# EAGLE design colorTemp (EAGLE 9.4.2)
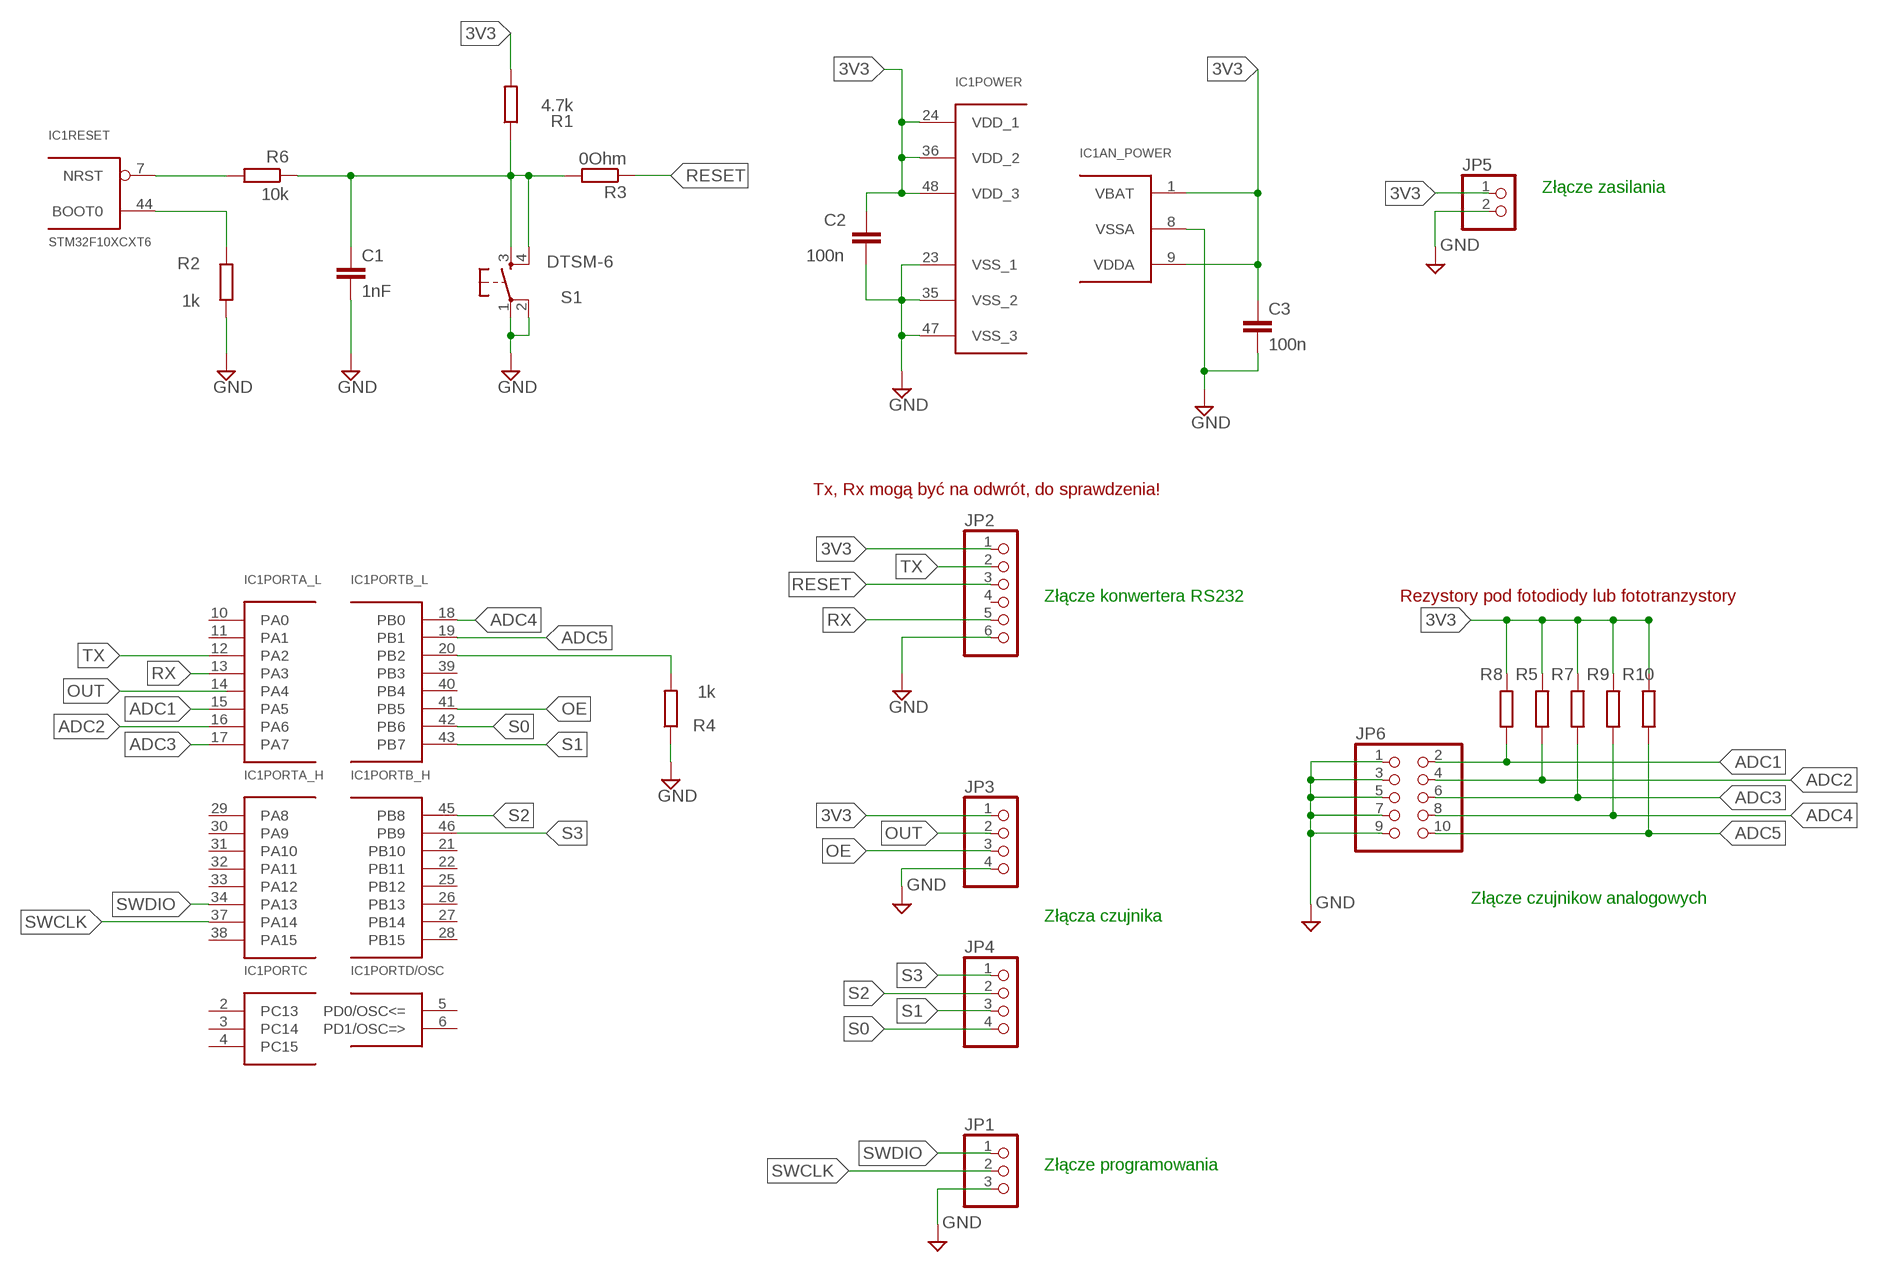
[diagram p0: schematic, sheet 1]

## Parts
C1  1nF  C-EUC0402  [C0402]
C2  100n  C-EUC0402  [C0402]
C3  100n  C-EUC0402  [C0402]
IC1  STM32F10XCXT6  [TQFP48]
JP1  PINHD-1X3  [1X03]
JP2  PINHD-1X6/90  [1X06/90]
JP3  PINHD-1X4  [1X04]
JP4  PINHD-1X4  [1X04]
JP5  PINHD-1X2  [1X02]
JP6  PINHD-2X5  [2X05]
R1  4.7k  R-EU_R0402  [R0402]
R2  1k  R-EU_R0402  [R0402]
R3  0Ohm  R-EU_R0402  [R0402]
R4  1k  R-EU_R0402  [R0402]
R5  R-EU_R0402  [R0402]
R6  10k  R-EU_R0402  [R0402]
R7  R-EU_R0402  [R0402]
R8  R-EU_R0402  [R0402]
R9  R-EU_R0402  [R0402]
R10  R-EU_R0402  [R0402]
S1  DTSM-6  [DTSM-6]

## Nets
3V3: C2.1 C3.1 IC1.1(AN_POWER:VBAT) IC1.9(AN_POWER:VDDA) IC1.24(POWER:VDD_1) IC1.36(POWER:VDD_2) IC1.48(POWER:VDD_3) JP2.1 JP3.1 JP5.1 R1.2 R5.1 R7.1 R8.1 R9.1 R10.1
ADC1: IC1.15(PORTA_L:PA5) JP6.2 R8.2
ADC2: IC1.16(PORTA_L:PA6) JP6.4 R5.2
ADC3: IC1.17(PORTA_L:PA7) JP6.6 R7.2
ADC4: IC1.18(PORTB_L:PB0) JP6.8 R9.2
ADC5: IC1.19(PORTB_L:PB1) JP6.10 R10.2
GND: C1.2 C2.2 C3.2 IC1.8(AN_POWER:VSSA) IC1.23(POWER:VSS_1) IC1.35(POWER:VSS_2) IC1.47(POWER:VSS_3) JP1.3 JP2.6 JP3.4 JP5.2 JP6.1 JP6.3 JP6.5 JP6.7 JP6.9 R2.1 R4.1 S1.1 S1.2
N$2: IC1.44(RESET:BOOT0) R2.2
N$9: IC1.20(PORTB_L:PB2) R4.2
N$18: IC1.7(RESET:NRST) R6.2
N$20: C1.1 R1.1 R3.2 R6.1 S1.3 S1.4
OE: IC1.41(PORTB_L:PB5) JP3.3
OUT: IC1.14(PORTA_L:PA4) JP3.2
RESET: JP2.3 R3.1
RX: IC1.13(PORTA_L:PA3) JP2.5
S0: IC1.42(PORTB_L:PB6) JP4.4
S1: IC1.43(PORTB_L:PB7) JP4.3
S2: IC1.45(PORTB_H:PB8) JP4.2
S3: IC1.46(PORTB_H:PB9) JP4.1
SWCLK: IC1.37(PORTA_H:PA14) JP1.2
SWDIO: IC1.34(PORTA_H:PA13) JP1.1
TX: IC1.12(PORTA_L:PA2) JP2.2
Unconnected: IC1.2(PORTC:PC13) IC1.3(PORTC:PC14) IC1.4(PORTC:PC15) IC1.5(PORTD/OSC:PD0/OSC<=) IC1.6(PORTD/OSC:PD1/OSC=>) IC1.10(PORTA_L:PA0) IC1.11(PORTA_L:PA1) IC1.21(PORTB_H:PB10) IC1.22(PORTB_H:PB11) IC1.25(PORTB_H:PB12) IC1.26(PORTB_H:PB13) IC1.27(PORTB_H:PB14) IC1.28(PORTB_H:PB15) IC1.29(PORTA_H:PA8) IC1.30(PORTA_H:PA9) IC1.31(PORTA_H:PA10) IC1.32(PORTA_H:PA11) IC1.33(PORTA_H:PA12) IC1.38(PORTA_H:PA15) IC1.39(PORTB_L:PB3) IC1.40(PORTB_L:PB4) JP2.4

## Notes on the sheet
- Złącze zasilania
- Tx, Rx mogą być na odwrót, do sprawdzenia!
- Złącze konwertera RS232 | Rezystory pod fotodiody lub fototranzystory
- Złącze czujnikow analogowych
- Złącza czujnika
- Złącze programowania

## Library data of the parts
C1-C3 = rcl:C-EU: CAPACITOR, European symbol; SPICEPREFIX: C
IC1 = stm32:STM32F10XCXT6: ST STM32F101/103 48pin LQFP
JP1 = pinhead:PINHD-1X3: PIN HEADER
JP2 = pinhead:PINHD-1X6: PIN HEADER
JP3 JP4 = pinhead:PINHD-1X4: PIN HEADER
JP5 = pinhead:PINHD-1X2: PIN HEADER
JP6 = pinhead:PINHD-2X5: PIN HEADER
R1-R10 = rcl:R-EU_: RESISTOR, European symbol; SPICEPREFIX: R
S1 = switch-tact:DTSM-6

## Board
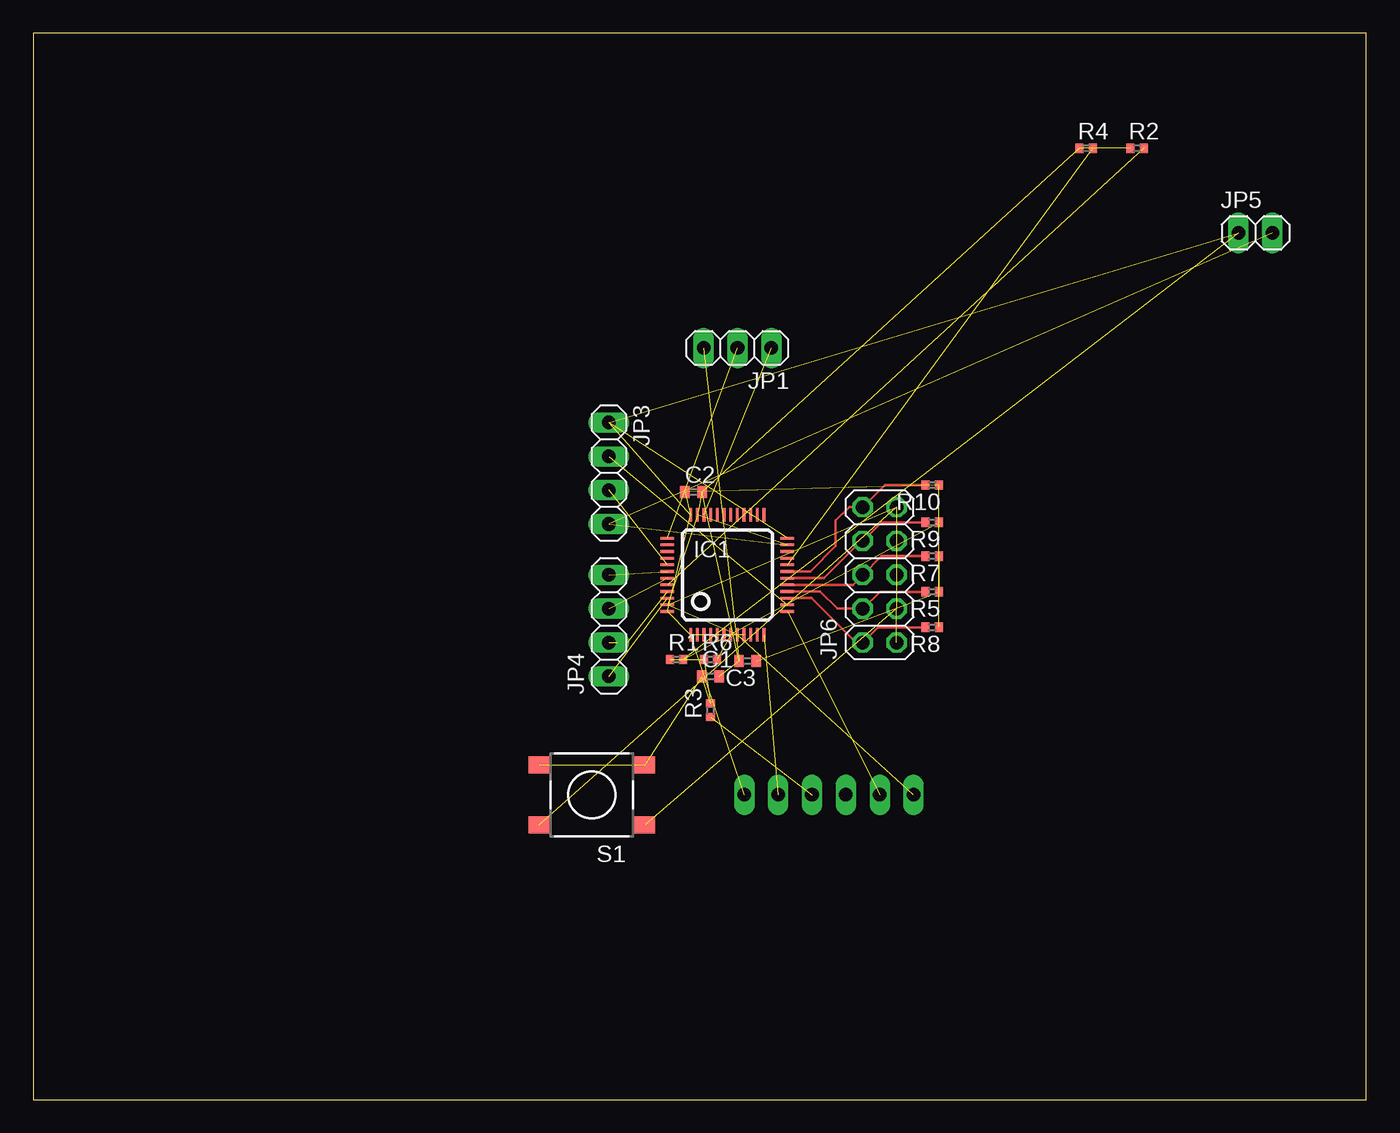
[diagram p1: board, top side]
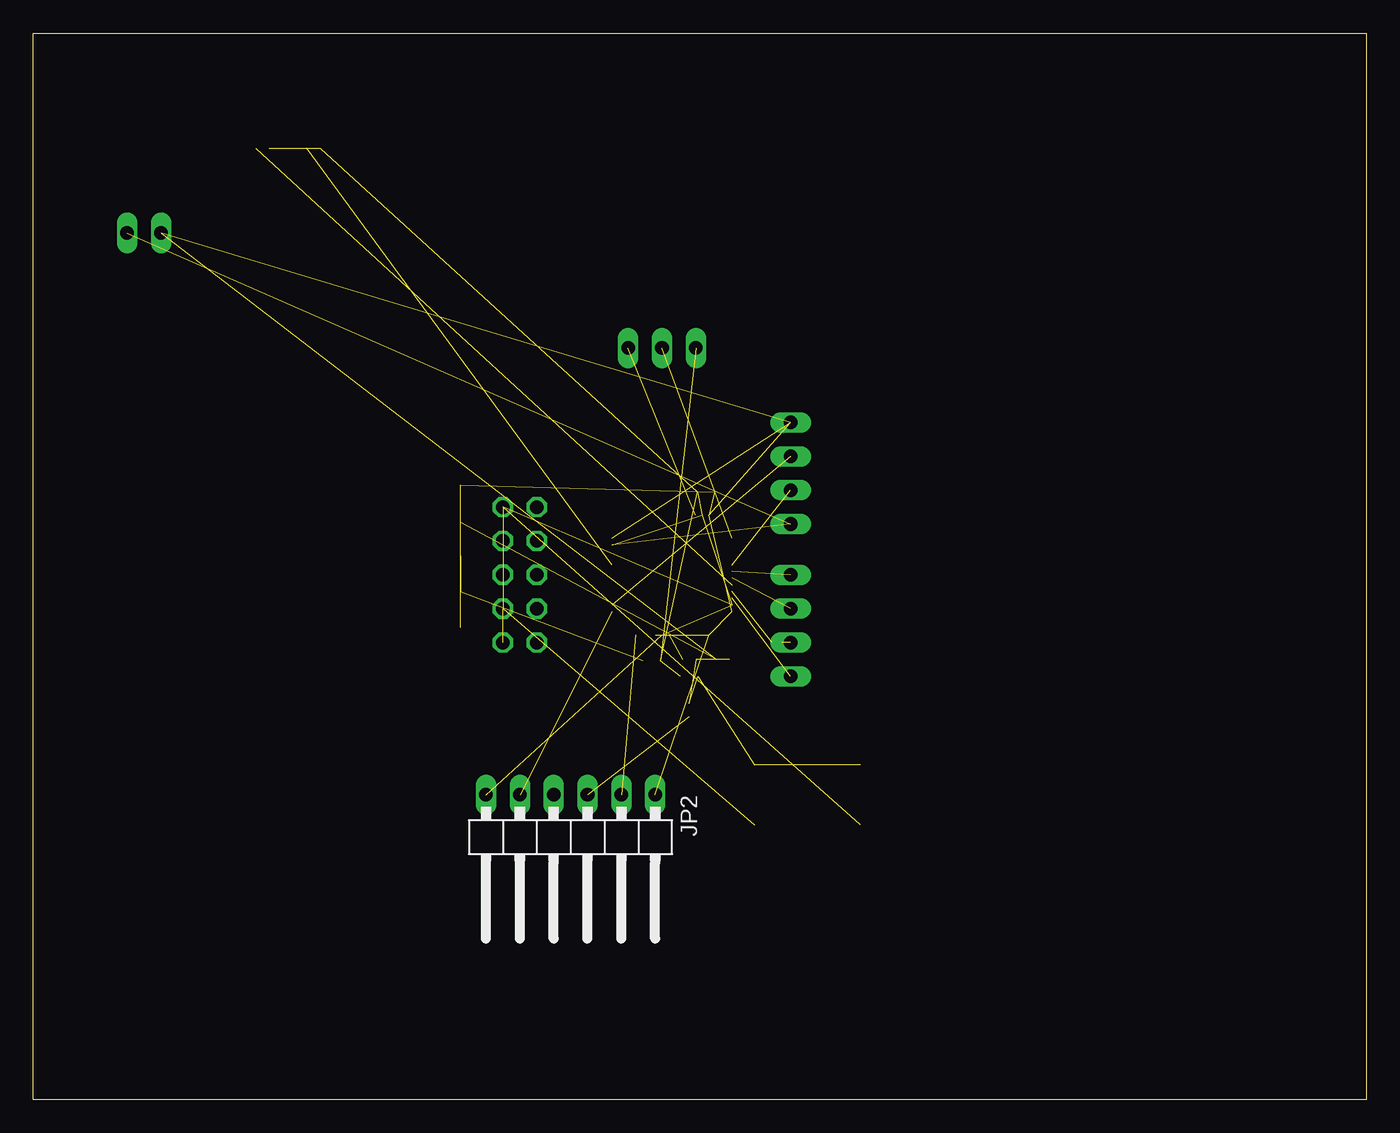
[diagram p2: board, bottom side, seen from below]

Size 100 x 80 mm. Coordinates in mm from the lower left corner, seen from the top.
Outline: 0,0 100,0 100,80 0,80 0,0
Copper layers (1*16): Top 0.035mm / dielectric 1.5mm / Bottom 0.035mm
Design rules "default": minimum track width 6mil, minimum drill 0.35mm, track to track 6mil, track to pad 6mil, pad to pad 6mil, via to via 6mil, smd to smd 6mil, copper to edge 40mil, drill to drill 6mil, minimum pad ring 10mil, minimum via ring 8mil, stop-mask expansion 4mil, vias tented up to drill 0mil, thermal gap 10mil

### Footprints (pad centres in the part's own frame; a part is rotated, then mirrored left to right if it is on the bottom)
C0402 = smd 0.7 x 0.9: 1 -0.65,0; 2 0.65,0
TQFP48 = smd 0.2 x 1: 1 -2.75,-4.5; 2 -2.25,-4.5; 3 -1.75,-4.5; 4 -1.25,-4.5; 5 -0.75,-4.5; 6 -0.25,-4.5; 7 0.25,-4.5; 8 0.75,-4.5; 9 1.25,-4.5; 10 1.75,-4.5; 11 2.25,-4.5; 12 2.75,-4.5; 25 2.75,4.5; 26 2.25,4.5; 27 1.75,4.5; 28 1.25,4.5; 29 0.75,4.5; 30 0.25,4.5; 31 -0.25,4.5; 32 -0.75,4.5; 33 -1.25,4.5; 34 -1.75,4.5; 35 -2.25,4.5; 36 -2.75,4.5 | smd 1 x 0.2: 13 4.5,-2.75; 14 4.5,-2.25; 15 4.5,-1.75; 16 4.5,-1.25; 17 4.5,-0.75; 18 4.5,-0.25; 19 4.5,0.25; 20 4.5,0.75; 21 4.5,1.25; 22 4.5,1.75; 23 4.5,2.25; 24 4.5,2.75; 37 -4.5,2.75; 38 -4.5,2.25; 39 -4.5,1.75; 40 -4.5,1.25; 41 -4.5,0.75; 42 -4.5,0.25; 43 -4.5,-0.25; 44 -4.5,-0.75; 45 -4.5,-1.25; 46 -4.5,-1.75; 47 -4.5,-2.25; 48 -4.5,-2.75
1X03 = drill 1.016 long: 1 -2.54,0; 2 0,0; 3 2.54,0
1X06/90 = drill 1.016 long: 1 -6.35,-3.81; 2 -3.81,-3.81; 3 -1.27,-3.81; 4 1.27,-3.81; 5 3.81,-3.81; 6 6.35,-3.81
1X04 = drill 1.016 long: 1 -3.81,0; 2 -1.27,0; 3 1.27,0; 4 3.81,0
1X02 = drill 1.016 long: 1 -1.27,0; 2 1.27,0
2X05 = drill 1.016 octagon: 1 -5.08,-1.27; 2 -5.08,1.27; 3 -2.54,-1.27; 4 -2.54,1.27; 5 0,-1.27; 6 0,1.27; 7 2.54,-1.27; 8 2.54,1.27; 9 5.08,-1.27; 10 5.08,1.27
R0402 = smd 0.6 x 0.7: 1 -0.5,0; 2 0.5,0
DTSM-6 = smd 1.55 x 1.3: 1 -3.975,2.25; 2 3.975,2.25; 3 -3.975,-2.25; 4 3.975,-2.25

### Placement (x,y rotation side)
C1  50.8,31.75 0 top
C2  49.53,45.59 0 top
C3  53.59,32.89 180 top
IC1  52.07,39.37 0 top
JP1  52.83,56.39 180 top
JP2  59.69,19.05 180 bottom
JP3  43.18,46.99 270 top
JP4  43.18,35.56 90 top
JP5  91.69,65.02 0 top
JP6  63.5,39.37 90 top
R1  48.26,33.02 0 top
R2  82.8,71.37 0 top
R3  50.8,29.21 90 top
R4  78.99,71.37 0 top
R5  67.44,38.1 180 top
R6  50.8,33.02 0 top
R7  67.44,40.77 180 top
R8  67.44,35.43 180 top
R9  67.44,43.31 180 top
R10  67.44,46.1 180 top
S1  41.91,22.86 180 top

### Tracks (layer width: path | path; a pad name or v marks a point on that pad's centre or on a via)
3V3  (15 unrouted)
ADC1
  Top 0.203: IC1.15 58.39,37.62 61.72,34.29 JP6.2 63.37,35.43 R8.2
ADC2
  Top 0.203: IC1.16 59.03,38.12 60.33,36.83 JP6.4 63.5,38.1 R5.2
ADC3
  Top 0.203: IC1.17 61.48,38.62 JP6.6 63.63,40.77 R7.2
ADC4
  Top 0.203: IC1.18 59.31,39.12 62.1,41.91 JP6.8 63.63,43.31 R9.2
ADC5
  Top 0.203: IC1.19 58.29,39.62 60.2,41.53 60.2,43.43 61.21,44.45 JP6.10 63.88,46.1 R10.2
GND  (19 unrouted)
N$2  (1 unrouted)
N$9  (1 unrouted)
N$18  (1 unrouted)
N$20  (5 unrouted)
OE  (1 unrouted)
OUT  (1 unrouted)
RESET  (1 unrouted)
RX  (1 unrouted)
S0  (1 unrouted)
S1  (1 unrouted)
S2  (2 unrouted)
  Top 0.203: 44.58,34.29 43.81,34.29
S3  (1 unrouted)
SWCLK  (1 unrouted)
SWDIO  (1 unrouted)
TX  (1 unrouted)